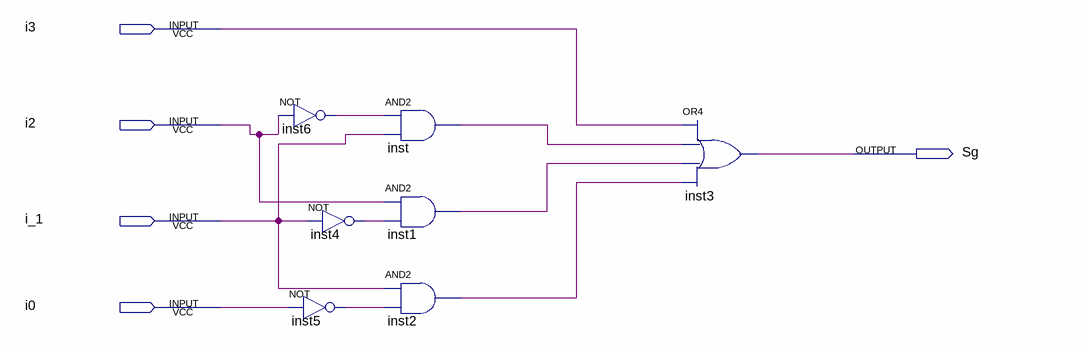
[diagram p0: schematic sheet]
// Quartus schematic lab05_g_top.bdf as structural Verilog: 7 symbols, 5 pins
module lab05_g_top (
  input  i3,
  input  i2,
  input  i_1,
  input  i0,
  output Sg
);

  wire inst1_out, inst2_out, inst4_out, inst5_out, inst6_out, inst_out;

  not inst6 (inst6_out, i2);
  not inst5 (inst5_out, i0);
  not inst4 (inst4_out, i_1);
  and inst (inst_out, inst6_out, i_1);
  and inst1 (inst1_out, i2, inst4_out);
  and inst2 (inst2_out, i_1, inst5_out);
  or inst3 (Sg, i3, inst_out, inst1_out, inst2_out);
endmodule
